# Altium project PCB_PowerAmplifier.PrjPcb
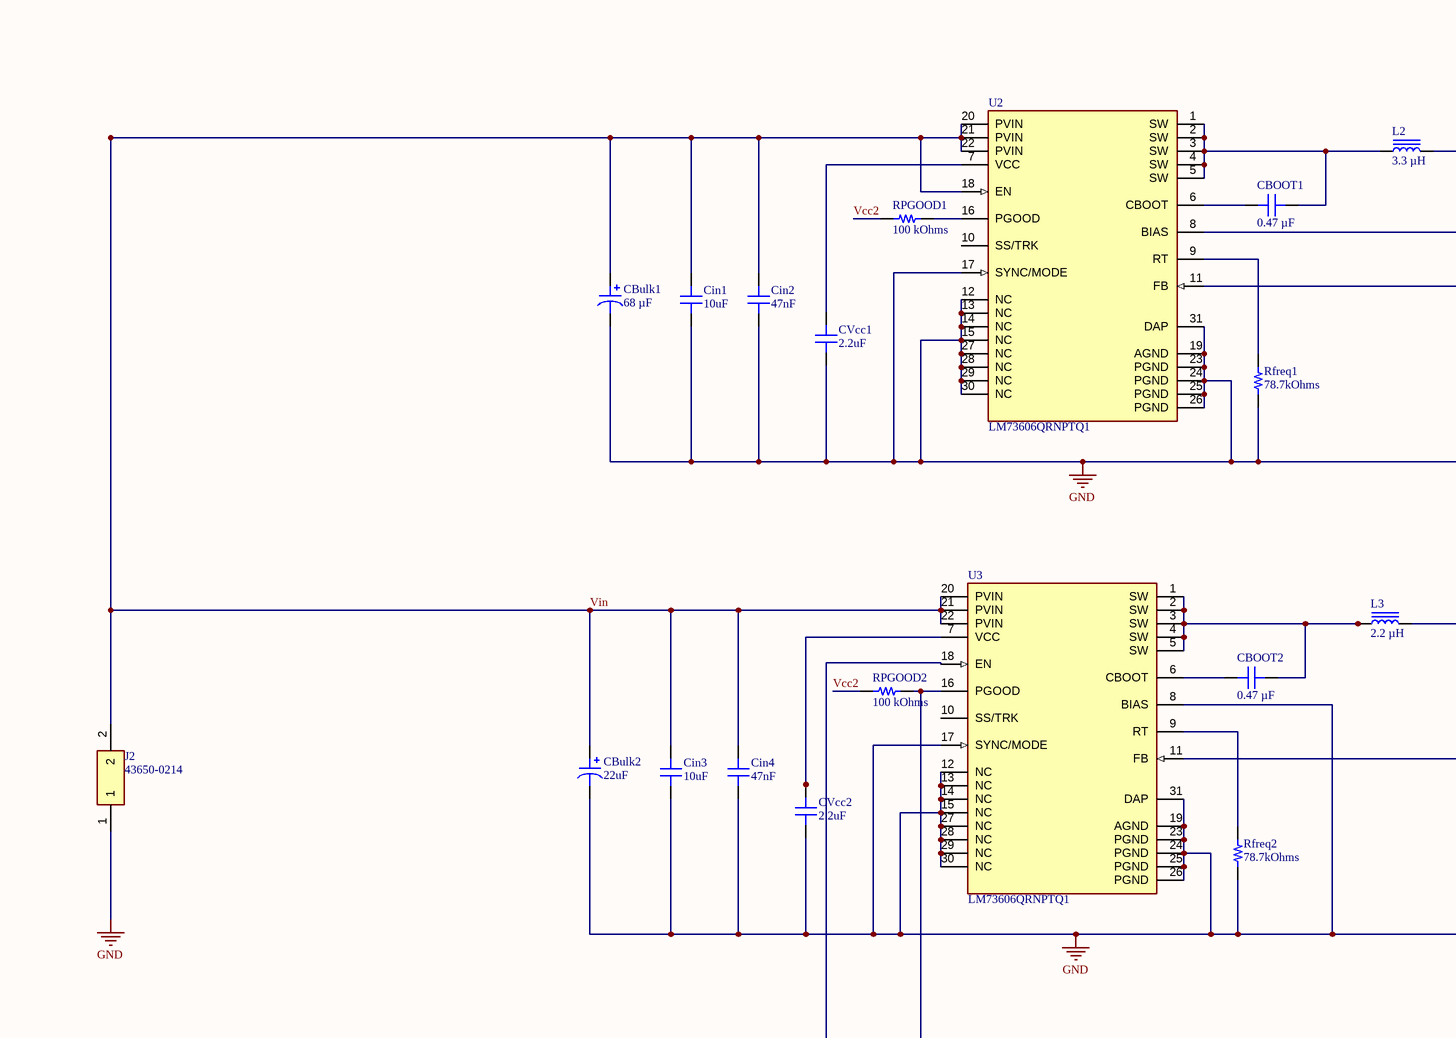
[diagram p0: Sheet1.SchDoc, top left]
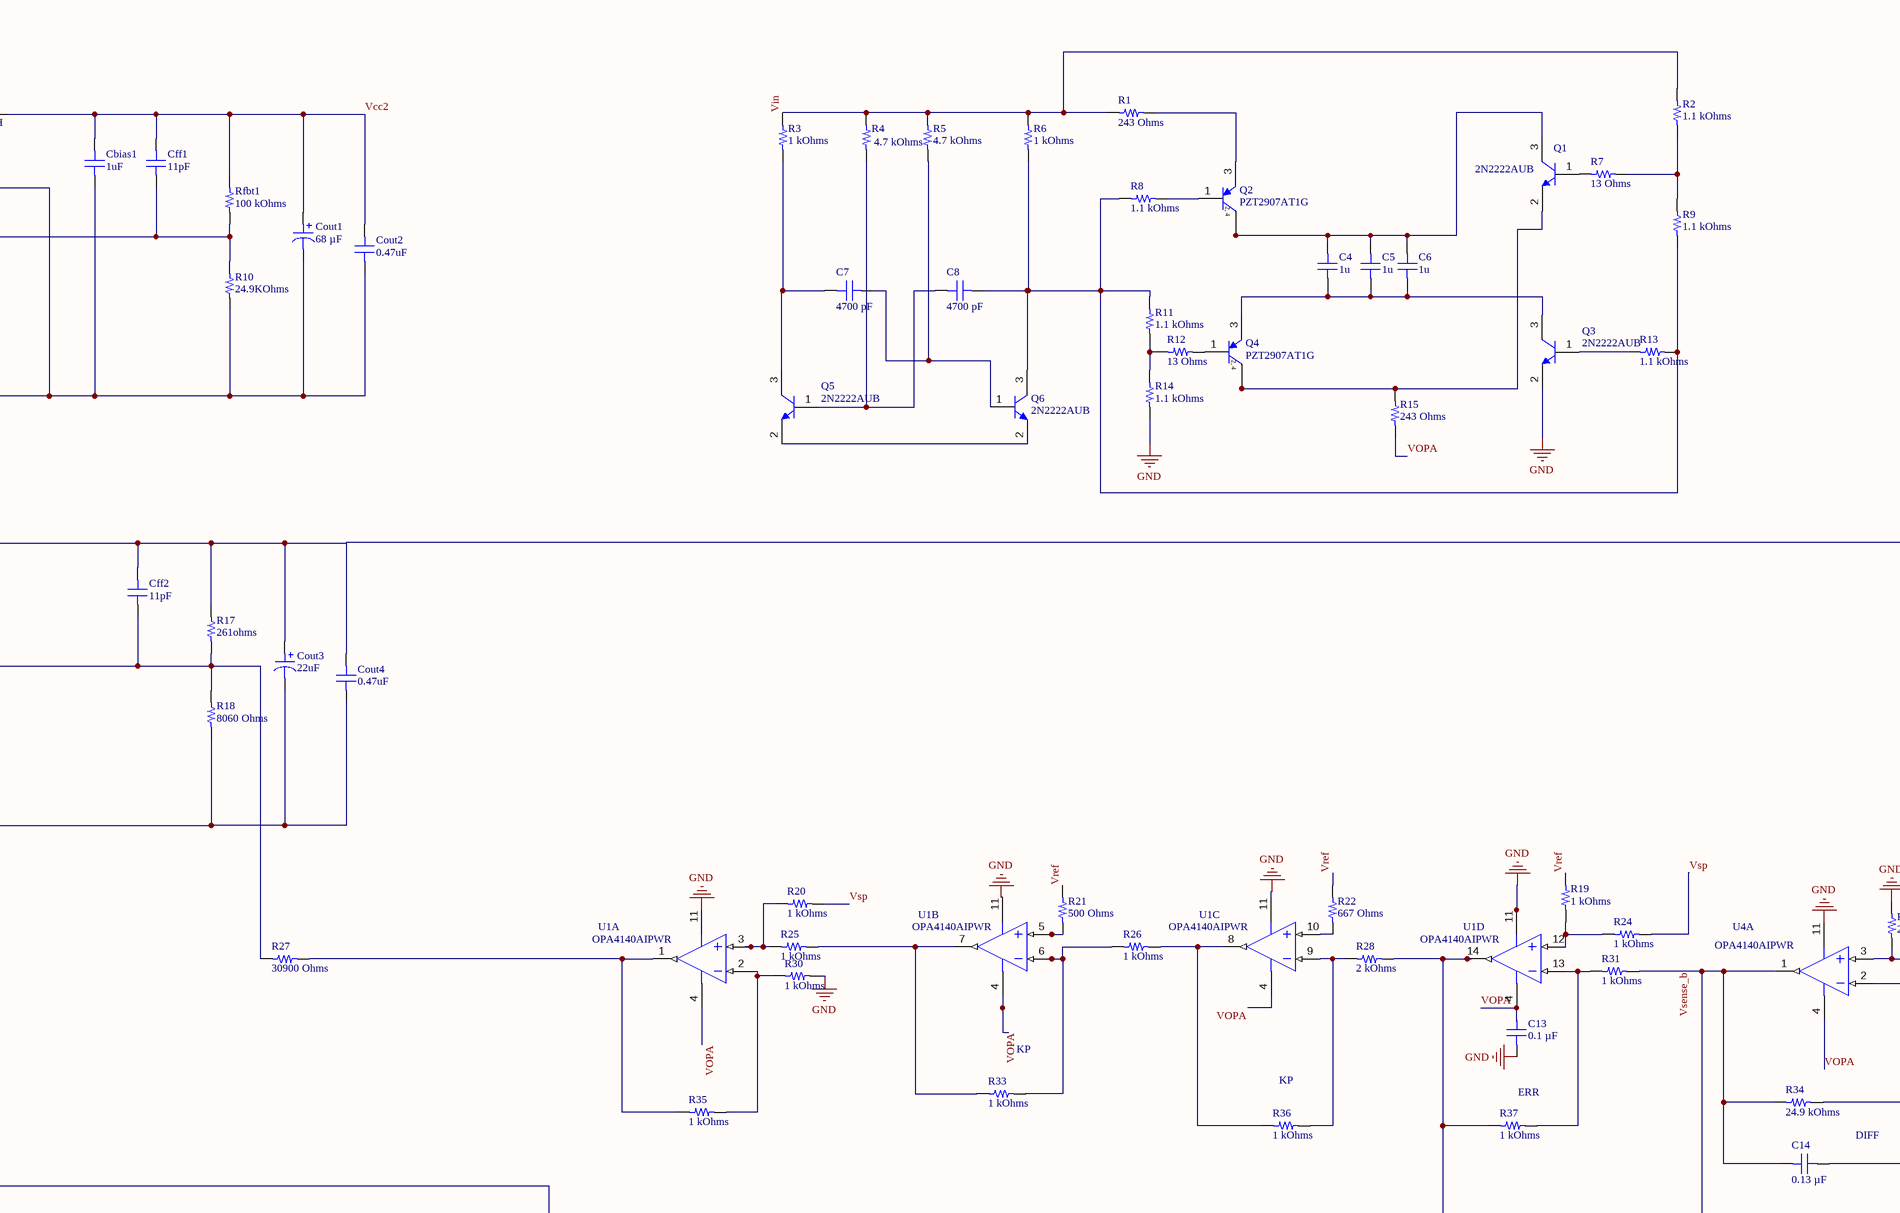
[diagram p1: Sheet1.SchDoc, top middle]
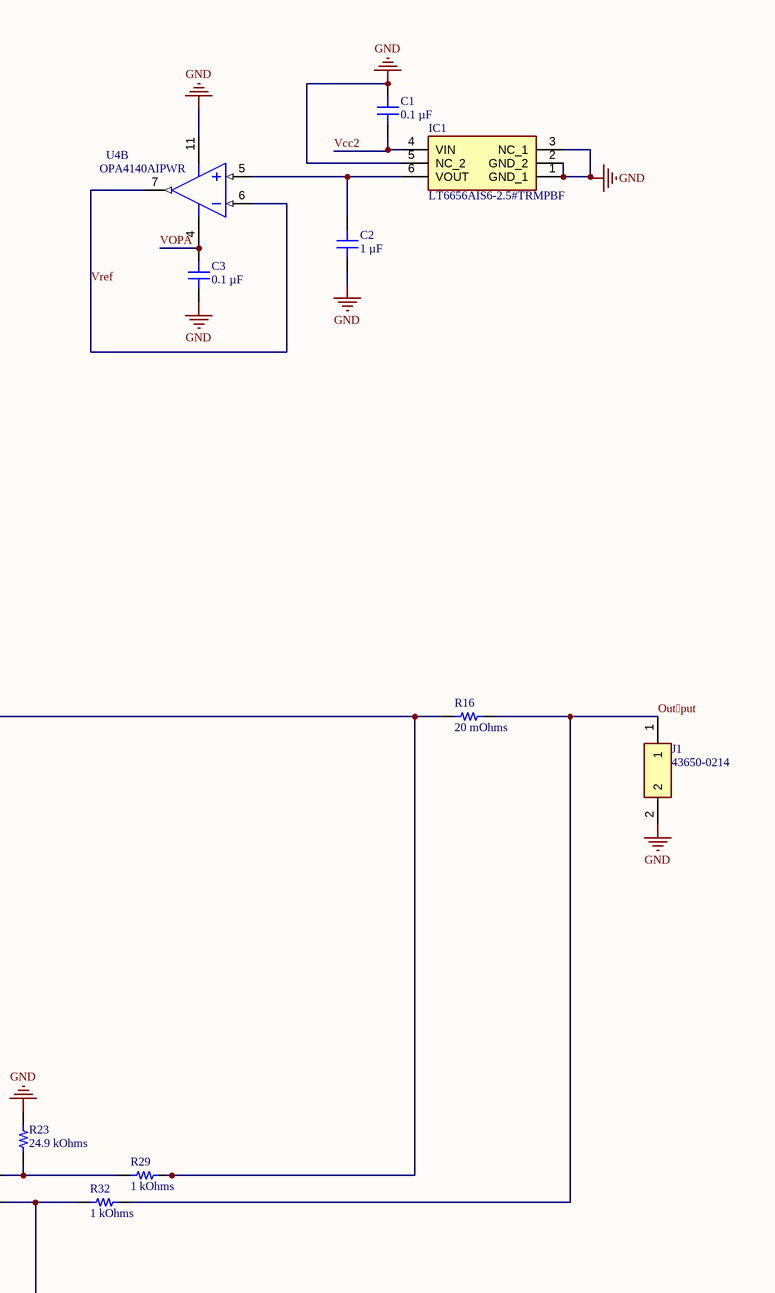
[diagram p2: Sheet1.SchDoc, top right]
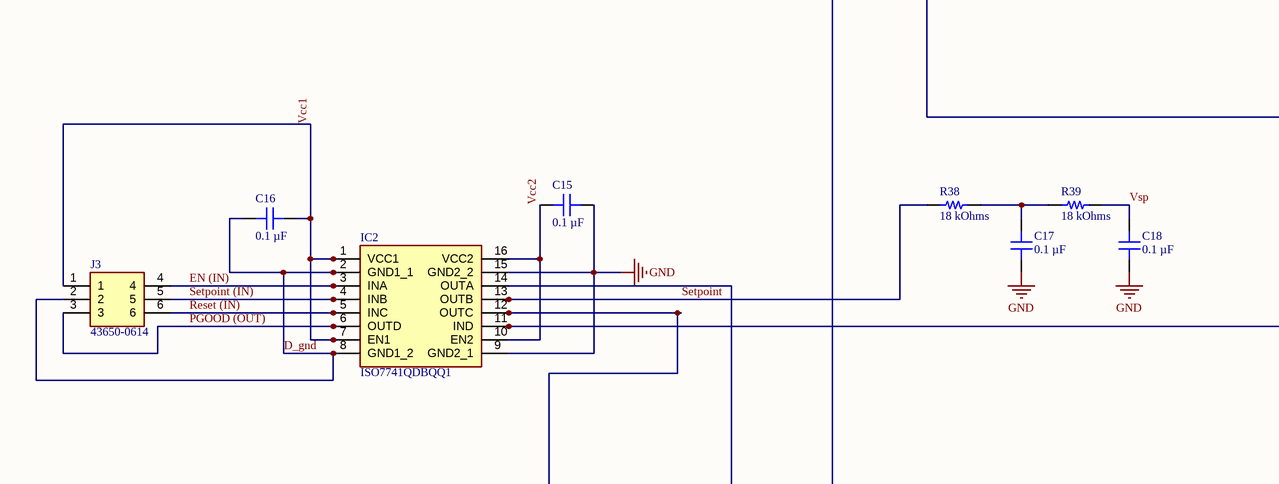
[diagram p3: Sheet1.SchDoc, bottom left]
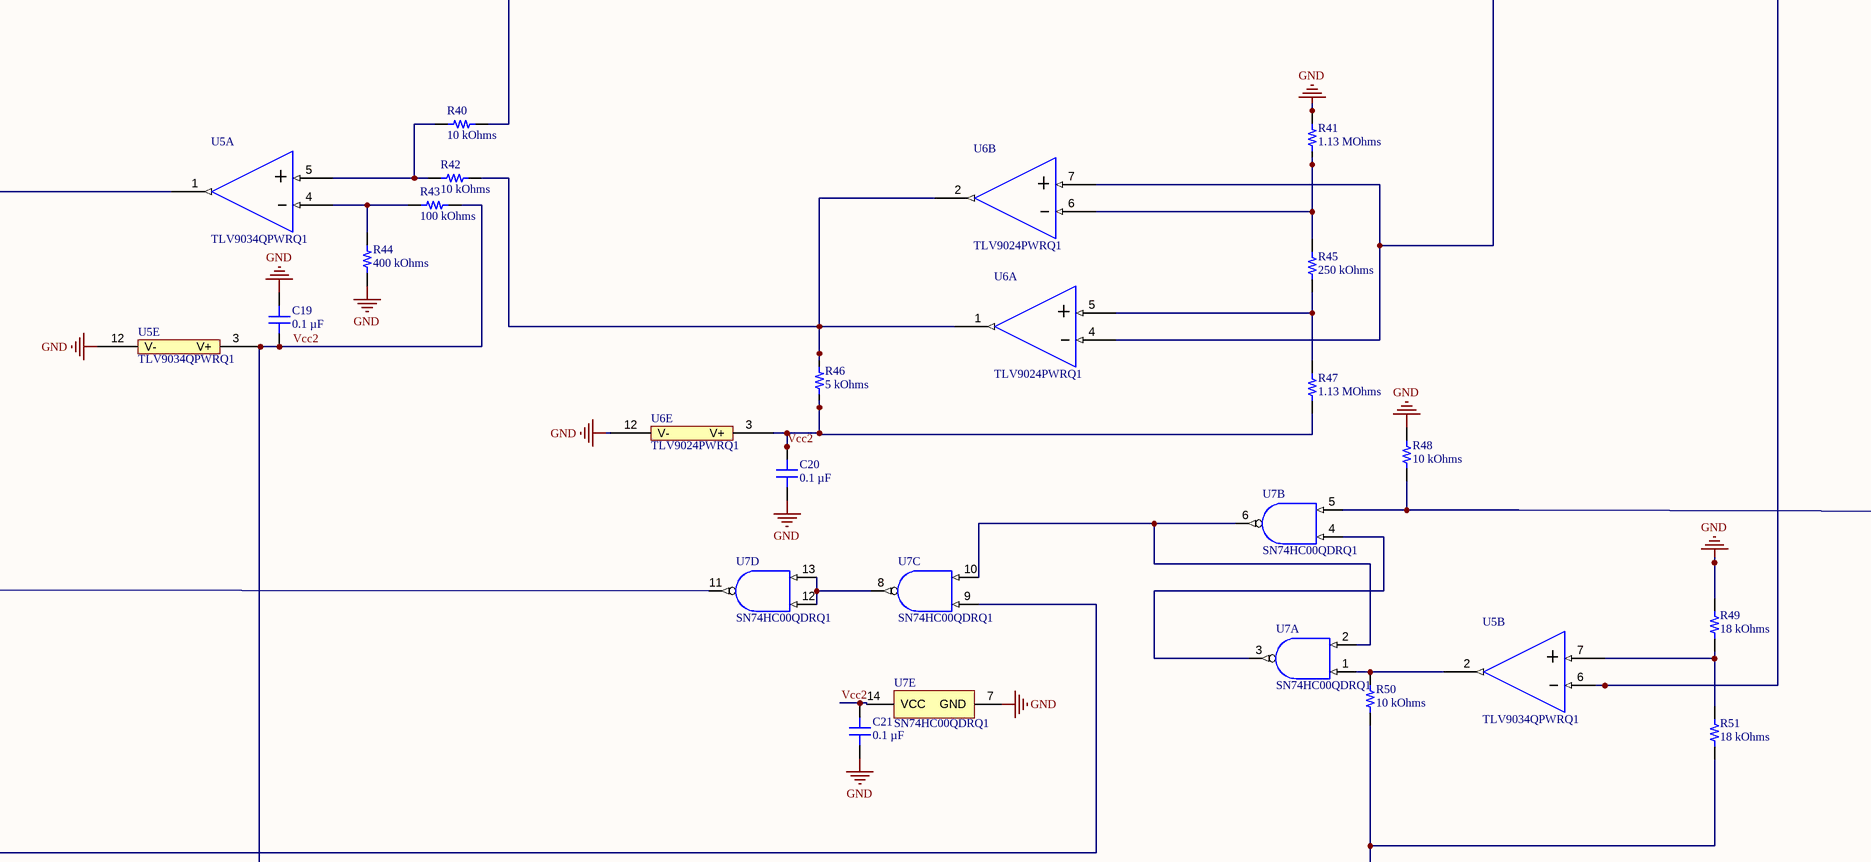
[diagram p4: Sheet1.SchDoc, bottom middle]
1 sheet, 110 parts. Net scope: global (net labels, ports and power ports of the same name join across sheets).
Board file: PCB1.PcbDoc

## Sheet Sheet1.SchDoc
size 863 x 558 mm; SheetNumber: 1; SheetTotal: 1

### Parts
C1  0.1 µF  [CAP 0805_2012]
C2  1 µF  [CAP 0805_2012]
C3  0.1 µF  [CAP 0805_2012]
C4  1u  [CAP 0805_2012]
C5  1u  [CAP 0805_2012]
C6  1u  [CAP 0805_2012]
C7  4700 pF  [CAP 0805_2012]
C8  4700 pF  [CAP 0805_2012]
C13  0.1 µF  [CAP 0805_2012]
C14  0.13 µF  [CAP 0805_2012]
C15  0.1 µF  [CAP 0805_2012]
C16  0.1 µF  [CAP 0805_2012]
C17  0.1 µF  [CAP 0805_2012]
C18  0.1 µF  [CAP 0805_2012]
C19  0.1 µF  [CAP 0805_2012]
C20  0.1 µF  [CAP 0805_2012]
C21  0.1 µF  [CAP 0805_2012]
Cbias1  1uF  [CAP 0805_2012]
CBOOT1  0.47 µF  [CAP 0805_2012]
CBOOT2  0.47 µF  [CAP 0805_2012]
CBulk1  68 µF  [CAP ALSMD 8.3MM H10.5MM]
CBulk2  22uF  [CAP ALSMD 8.3MM H10.5MM]
Cff1  11pF  [CAP 0805_2012]
Cff2  11pF  [CAP 0805_2012]
Cin1  10uF  [CAP 0805_2012]
Cin2  47nF  [CAP 0805_2012]
Cin3  10uF  [CAP 0805_2012]
Cin4  47nF  [CAP 0805_2012]
Cout1  68 µF  [CAP ALSMD 8.3MM H10.5MM]
Cout2  0.47uF  [CAP 0805_2012]
Cout3  22uF  [CAP ALSMD 8.3MM H10.5MM]
Cout4  0.47uF  [CAP 0805_2012]
CVcc1  2.2uF  [CAP 0805_2012]
CVcc2  2.2uF  [CAP 0805_2012]
IC1  LT6656AIS6-2.5#TRMPBF  [SOT95P280X100-6N]
IC2  ISO7741QDBQQ1  [SOP64P600X175-16N]
J1  43650-0214  [43650-02(12,13,14)]
J2  43650-0214  [43650-02(12,13,14)]
J3  43650-0614  [43650-06(12,13,14)]
L2  3.3 µH  [BOURNS SRR1280]
L3  2.2 µH  [WURTH WE-PD 1210]
Q1  2N2222AUB  [MCSM-2N2222AUB-3]
Q2  PZT2907AT1G  [ONSC-SOT-223-4-318E-04_V]
Q3  2N2222AUB  [MCSM-2N2222AUB-3]
Q4  PZT2907AT1G  [ONSC-SOT-223-4-318E-04_V]
Q5  2N2222AUB  [MCSM-2N2222AUB-3]
Q6  2N2222AUB  [MCSM-2N2222AUB-3]
R1  243 Ohms  [RES 0805_2012]
R2  1.1 kOhms  [RES 0805_2012]
R3  1 kOhms  [RES 0805_2012]
R4  4.7 kOhms  [RES 0805_2012]
R5  4.7 kOhms  [RES 0805_2012]
R6  1 kOhms  [RES 0805_2012]
R7  13 Ohms  [RES 0805_2012]
R8  1.1 kOhms  [RES 0805_2012]
R9  1.1 kOhms  [RES 0805_2012]
R10  24.9KOhms  [RES 0805_2012]
R11  1.1 kOhms  [RES 0805_2012]
R12  13 Ohms  [RES 0805_2012]
R13  1.1 kOhms  [RES 0805_2012]
R14  1.1 kOhms  [RES 0805_2012]
R15  243 Ohms  [RES 0805_2012]
R16  20 mOhms  [RES 0805_2012]
R17  261ohms  [RES 0805_2012]
R18  8060 Ohms  [RES 0805_2012]
R19  1 kOhms  [RES 0805_2012]
R20  1 kOhms  [RES 0805_2012]
R21  500 Ohms  [RES 0805_2012]
R22  667 Ohms  [RES 0805_2012]
R23  24.9 kOhms  [RES 0805_2012]
R24  1 kOhms  [RES 0805_2012]
R25  1 kOhms  [RES 0805_2012]
R26  1 kOhms  [RES 0805_2012]
R27  30900 Ohms  [RES 0805_2012]
R28  2 kOhms  [RES 0805_2012]
R29  1 kOhms  [RES 0805_2012]
R30  1 kOhms  [RES 0805_2012]
R31  1 kOhms  [RES 0805_2012]
R32  1 kOhms  [RES 0805_2012]
R33  1 kOhms  [RES 0805_2012]
R34  24.9 kOhms  [RES 0805_2012]
R35  1 kOhms  [RES 0805_2012]
R36  1 kOhms  [RES 0805_2012]
R37  1 kOhms  [RES 0805_2012]
R38  18 kOhms  [RES 0805_2012]
R39  18 kOhms  [RES 0805_2012]
R40  10 kOhms  [RES 0805_2012]
R41  1.13 MOhms  [RES 0805_2012]
R42  10 kOhms  [RES 0805_2012]
R43  100 kOhms  [RES 0805_2012]
R44  400 kOhms  [RES 0805_2012]
R45  250 kOhms  [RES 0805_2012]
R46  5 kOhms  [RES 0805_2012]
R47  1.13 MOhms  [RES 0805_2012]
R48  10 kOhms  [RES 0805_2012]
R49  18 kOhms  [RES 0805_2012]
R50  10 kOhms  [RES 0805_2012]
R51  18 kOhms  [RES 0805_2012]
Rfbt1  100 kOhms  [RES 0805_2012]
Rfreq1  78.7kOhms  [RES 0805_2012]
Rfreq2  78.7kOhms  [RES 0805_2012]
RPGOOD1  100 kOhms  [RES 0805_2012]
RPGOOD2  100 kOhms  [RES 0805_2012]
U1  OPA4140AIPWR  [PW0014A_L]  (parts A,B,C,D of 4)
U2  LM73606QRNPTQ1  [FP-RNP0030A-IPC_C]
U3  LM73606QRNPTQ1  [FP-RNP0030A-IPC_C]
U4  OPA4140AIPWR  [PW0014A_L]  (parts A,B of 4)
U5  TLV9034QPWRQ1  [TSOP65P640X120-14N]  (parts A,B,E of 5)
U6  TLV9024PWRQ1  [TSOP65P640X120-14N]  (parts A,B,E of 5)
U7  SN74HC00QDRQ1  [D0014A_L]  (parts A,B,C,D,E of 5)

### Nets
GND: C1.2 C2.1 C3.1 C13.1 C15.1 C17.1 C18.1 C19.2 C20.1 C21.1 Cbias1.1 CBulk1.2 CBulk2.2 Cin1.2 Cin2.2 Cin3.2 Cin4.2 Cout1.2 Cout2.1 Cout3.2 Cout4.1 CVcc1.2 CVcc2.2 IC1.1(GND_1) IC1.2(GND_2) IC1.3(NC_1) IC1.5(NC_2) IC2.9(GND2_1) IC2.15(GND2_2) J1.2 J2.1 Q3.2(E) R10.1 R14.2 R18.1 R23.1 R30.2 R41.2 R44.1 R48.2 R49.2 Rfreq1.1 Rfreq2.1 U1.11(V-) U2.8(BIAS) U2.12(NC) U2.13(NC) U2.14(NC) U2.15(NC) U2.17(SYNC/MODE) U2.19(AGND) U2.23(PGND) U2.24(PGND) U2.25(PGND) U2.26(PGND) U2.27(NC) U2.28(NC) U2.29(NC) U2.30(NC) U2.31(DAP) U3.8(BIAS) U3.12(NC) U3.13(NC) U3.14(NC) U3.15(NC) U3.17(SYNC/MODE) U3.19(AGND) U3.23(PGND) U3.24(PGND) U3.25(PGND) U3.26(PGND) U3.27(NC) U3.28(NC) U3.29(NC) U3.30(NC) U3.31(DAP) U4.11(V-) U5.12(V-) U6.12(V-) U7.7(GND)
D_gnd: C16.2 IC2.2(GND1_1) IC2.8(GND1_2) J3.2
EN (IN): IC2.3(INA) J3.4
Output: J1.1 R16.2 R32.2
PGOOD (OUT): IC2.6(OUTD) J3.3
Reset (IN): IC2.5(INC) J3.6
Setpoint: IC2.13(OUTB) R38.1
Setpoint (IN): IC2.4(INB) J3.5
Vcc1: C16.1 IC2.1(VCC1) IC2.7(EN1) J3.1
Vcc2: C1.1 C15.2 C19.1 C20.2 C21.2 Cbias1.2 Cff1.2 Cout1.1 Cout2.2 IC1.4(VIN) IC2.10(EN2) IC2.16(VCC2) L2.2 R43.1 R46.1 R47.1 R50.1 R51.1 Rfbt1.2 RPGOOD1.2 RPGOOD2.2 U5.3(V+) U6.3(V+) U7.14(VCC)
Vin: CBulk1.1 CBulk2.1 Cin1.1 Cin2.1 Cin3.1 Cin4.1 J2.2 R1.1 R2.1 R3.2 R4.2 R5.2 R6.2 U2.18(EN) U2.20(PVIN) U2.21(PVIN) U2.22(PVIN) U3.20(PVIN) U3.21(PVIN) U3.22(PVIN)
VOPA: C3.2 C13.2 R15.1 U1.4(V+) U4.4(V+)
Vref: R19.2 R21.2 R22.2 U4.6(IN_B-) U4.7(OUT_B)
Vsense_b: C14.2 R31.2 R34.2 U4.1(OUT_A) U5.6(IN2-)
Vsp: C18.2 R20.2 R24.2 R39.2
NetC2_2: C2.2 IC1.6(VOUT) U4.5(IN_B+)
NetC4_1: C4.1 C5.1 C6.1 Q3.3(C) Q4.3(E)
NetC4_2: C4.2 C5.2 C6.2 Q1.3(C) Q2.2(C) Q2.4(C)
NetC7_1: C7.1 Q5.3(C) R3.1
NetC7_2: C7.2 Q6.1(B) R5.1
NetC8_1: C8.1 Q5.1(B) R4.1
NetC8_2: C8.2 Q6.3(C) R6.1 R8.2 R9.2 R11.1 R13.1
NetC14_1: C14.1 R32.1 R34.1 U4.2(IN_A-)
NetC17_2: C17.2 R38.2 R39.1
NetCBOOT1_1: CBOOT1.1 L2.1 U2.1(SW) U2.2(SW) U2.3(SW) U2.4(SW) U2.5(SW)
NetCBOOT1_2: CBOOT1.2 U2.6(CBOOT)
NetCBOOT2_1: CBOOT2.1 L3.1 U3.1(SW) U3.2(SW) U3.3(SW) U3.4(SW) U3.5(SW)
NetCBOOT2_2: CBOOT2.2 U3.6(CBOOT)
NetCff1_1: Cff1.1 R10.2 Rfbt1.1 U2.11(FB)
NetCff2_1: Cff2.1 R17.1 R18.2 R27.1 U3.11(FB)
NetCff2_2: Cff2.2 Cout3.1 Cout4.2 L3.2 R17.2
NetCVcc1_1: CVcc1.1 U2.7(VCC)
NetCVcc2_1: CVcc2.1 U3.7(VCC)
NetIC2_11: IC2.11(IND) U5.1(OUT2)
NetIC2_12: IC2.12(OUTC) R48.1 U7.5(2B)
NetIC2_14: IC2.14(OUTA) U7.9(3A)
NetQ1_1: Q1.1(B) R7.1
NetQ1_2: Q1.2(E) Q4.2(C) Q4.4(C) R15.2
NetQ2_1: Q2.1(B) R8.1
NetQ2_3: Q2.3(E) R1.2
NetQ3_1: Q3.1(B) R13.2
NetQ4_1: Q4.1(B) R12.2
NetQ5_2: Q5.2(E) Q6.2(E)
NetR2_2: R2.2 R7.2 R9.1
NetR11_2: R11.2 R12.1 R14.1
NetR16_1: R16.1 R29.2
NetR19_1: R19.1 R24.1 U1.12(IN_D+)
NetR20_1: R20.1 R25.1 U1.3(IN_A+)
NetR21_1: R21.1 U1.5(IN_B+)
NetR22_1: R22.1 U1.10(IN_C+)
NetR23_2: R23.2 R29.1 U4.3(IN_A+)
NetR25_2: R25.2 R33.1 U1.7(OUT_B)
NetR26_1: R26.1 R33.2 U1.6(IN_B-)
NetR26_2: R26.2 R36.1 U1.8(OUT_C)
NetR27_2: R27.2 R35.1 U1.1(OUT_A)
NetR28_1: R28.1 R36.2 U1.9(IN_C-)
NetR28_2: R28.2 R37.1 U1.14(OUT_D) U6.4(IN1-) U6.7(IN2+)
NetR30_1: R30.1 R35.2 U1.2(IN_A-)
NetR31_1: R31.1 R37.2 U1.13(IN_D-)
NetR40_1: R40.1 RPGOOD2.1 U3.16(PGOOD)
NetR40_2: R40.2 R42.2 U5.5(IN1+)
NetR41_1: R41.1 R45.2 U6.6(IN2-)
NetR42_1: R42.1 R46.2 U6.1(OUT2) U6.2(OUT1)
NetR43_2: R43.2 R44.2 U5.4(IN1-)
NetR45_1: R45.1 R47.2 U6.5(IN1+)
NetR49_1: R49.1 R51.2 U5.7(IN2+)
NetR50_2: R50.2 U5.2(OUT1) U7.1(1A)
NetRfreq1_2: Rfreq1.2 U2.9(RT)
NetRfreq2_2: Rfreq2.2 U3.9(RT)
NetRPGOOD1_1: RPGOOD1.1 U2.16(PGOOD)
NetU3_18: U3.18(EN) U7.11(4Y)
NetU7_2: U7.2(1B) U7.6(2Y) U7.10(3B)
NetU7_3: U7.3(1Y) U7.4(2A)
NetU7_8: U7.8(3Y) U7.12(4A) U7.13(4B)

Not connected (* = marked no-connect by the designer): U2 10(SS/TRK); U3 10(SS/TRK)

### Notes on the sheet
- (near R33) KP
- (near R36) KP
- (near R37) ERR
- DIFF
- DWG. NO.
- REV.
- SHT.
- REVISION
- DESCRIPTION
- DATE
- APPROVED
- THIS DOCUMENT AND THE DATA DISCLOSED HEREIN OR HEREWITH IS THE PROPERTY OF ALTIUM LIMITED AND MAY BE FREELY DISTRIBUTED IN WHOLE. NO RIGHTS ARE RESERVED OR EXPRESS OR IMPLIED WARANTEE GIVEN.
- ENG:
- DSN:
- APPROVALS
- PROJECT
- DOCUMENT REVISION:
- DESIGN ITEM:
- CHK:
- BOM:
- REFERENCE DOCUMENTS
- PROJECT REVISION:
- TITLE
- FAB DWG:
- PCB DWG:
- ASSY DWG:
- SCALE:
- SIZE
- D
- CAGE CODE
- FILE NAME
- DWG NO.
- SHEET
- OF
- REV
- (in symbol CMP-1048-00010-1) 2, 4

### Library data of the parts
C1 C3 C13 = CC0805MRX7R9BB104: CAP CER 0.1UF 50V X7R 0805; manufacturer: Yageo; Tolerance: ±20%; Part Number: CC0805MRX7R9BB104; Value: 0.1 µF; Applications: General Purpose; Capacitance: 0.1 µF; componentlink1description: Datasheet; componentlink1url: https://www.yageo.com/upload/media/product/productsearch/datasheet/mlcc/UPY-GPHC_X7R_6.3V-to-50V_18.pdf; componentlink2description: DigiKey Link; componentlink2url: https://www.digikey.com/en/products/detail/yageo/CC0805MRX7R9BB104/5884281; Device Package: 0805 (2012 Metric); lastupdated: 09-08-2023 19:14:28; Lifecycle Status: Active; Minimum Order: 1; Mounting Type: Surface Mount, MLCC; Operating Temperature: -55°C ~ 125°C; Package / Case: 0805 (2012 Metric); packaging: TapeAndReel; partid: 2475; Part Status: Active; price: 0.01; series: CC; Size / Dimension: 0.079" L x 0.049" W (2.00mm x 1.25mm); Supplier 1: DigiKey; Supplier Part Number 1: 311-4351-1-ND; Temperature Coefficient: X7R; Thickness (Max): 0.037" (0.95mm); Voltage - Rated: 50V
C2 C14 = CC0805MRX7R9BB104: CAP CER 0.1UF 50V X7R 0805; manufacturer: Yageo; Capacitance: 0.1 µF; Tolerance: ±20%; Part Number: CC0805MRX7R9BB104; Applications: General Purpose; componentlink1description: Datasheet; componentlink1url: https://www.yageo.com/upload/media/product/productsearch/datasheet/mlcc/UPY-GPHC_X7R_6.3V-to-50V_18.pdf; componentlink2description: DigiKey Link; componentlink2url: https://www.digikey.com/en/products/detail/yageo/CC0805MRX7R9BB104/5884281; Device Package: 0805 (2012 Metric); lastupdated: 09-08-2023 19:14:28; Lifecycle Status: Active; Minimum Order: 1; Mounting Type: Surface Mount, MLCC; Operating Temperature: -55°C ~ 125°C; Package / Case: 0805 (2012 Metric); packaging: TapeAndReel; partid: 2475; Part Status: Active; price: 0.01; series: CC; Size / Dimension: 0.079" L x 0.049" W (2.00mm x 1.25mm); Supplier 1: DigiKey; Supplier Part Number 1: 311-4351-1-ND; Temperature Coefficient: X7R; Thickness (Max): 0.037" (0.95mm); Voltage - Rated: 50V
  C2: Value: 1 µF
  C14: Value: 0.13 µF
C4-C6 = C0805C472F3GECAUTO7210: CAP CER 0805 4.7NF 25V C0G 1%; manufacturer: KEMET; Capacitance: 4700 pF; Temperature Coefficient: C0G, NP0; Part Number: C0805C472F3GECAUTO7210; Value: 1u; Applications: Automotive, ESD Protection; componentlink1description: Datasheet; componentlink1url: https://connect.kemet.com:7667/gateway/IntelliData-ComponentDocumentation/1.0/download/datasheet/C0805C472F3GECAUTO7210; componentlink2description: DigiKey Link; componentlink2url: https://www.digikey.com/en/products/detail/kemet/C0805C472F3GECAUTO7210/8648690; Device Package: 0805 (2012 Metric); Features: Low ESL; lastupdated: 15-11-2023 20:12:00; Lifecycle Status: Active; Minimum Order: 1; Mounting Type: Surface Mount, MLCC; Operating Temperature: -55°C ~ 125°C; Package / Case: 0805 (2012 Metric); packaging: TapeAndReel; partid: 54380; Part Status: Active; price: 0.30; Ratings: AEC-Q200; series: ESD SMD Auto C0G; Size / Dimension: 0.079" L x 0.049" W (2.00mm x 1.25mm); Supplier 1: DigiKey; Supplier Part Number 1: 399-C0805C472F3GECAUTO7210CT-ND; Thickness (Max): 0.039" (1.00mm); Tolerance: ±1%; Voltage - Rated: 25V
C7 C8 = C0805C472F3GECAUTO7210: CAP CER 0805 4.7NF 25V C0G 1%; manufacturer: KEMET; Temperature Coefficient: C0G, NP0; Part Number: C0805C472F3GECAUTO7210; Value: 4700 pF; Applications: Automotive, ESD Protection; Capacitance: 4700 pF; componentlink1description: Datasheet; componentlink1url: https://connect.kemet.com:7667/gateway/IntelliData-ComponentDocumentation/1.0/download/datasheet/C0805C472F3GECAUTO7210; componentlink2description: DigiKey Link; componentlink2url: https://www.digikey.com/en/products/detail/kemet/C0805C472F3GECAUTO7210/8648690; Device Package: 0805 (2012 Metric); Features: Low ESL; lastupdated: 15-11-2023 20:12:00; Lifecycle Status: Active; Minimum Order: 1; Mounting Type: Surface Mount, MLCC; Operating Temperature: -55°C ~ 125°C; Package / Case: 0805 (2012 Metric); packaging: TapeAndReel; partid: 54380; Part Status: Active; price: 0.30; Ratings: AEC-Q200; series: ESD SMD Auto C0G; Size / Dimension: 0.079" L x 0.049" W (2.00mm x 1.25mm); Supplier 1: DigiKey; Supplier Part Number 1: 399-C0805C472F3GECAUTO7210CT-ND; Thickness (Max): 0.039" (1.00mm); Tolerance: ±1%; Voltage - Rated: 25V
C15-C21 = 250X15W104MV4E: CAP CER 0.1UF 25V X7R 0805; manufacturer: Johanson Dielectrics Inc.; Tolerance: ±20%; Part Number: 250X15W104MV4E; Value: 0.1 µF; Applications: Bypass, Decoupling; Capacitance: 0.1 µF; componentlink1description: Datasheet; componentlink1url: https://www.johansondielectrics.com/downloads/x2y-filter-and-decoupling-capacitors.pdf; componentlink2description: DigiKey Link; componentlink2url: https://www.digikey.com/en/products/detail/johanson-dielectrics-inc/250X15W104MV4E/2327204; Device Package: 0805 (2012 Metric); Features: Low ESL (X2Y); lastupdated: 01-11-2023 19:15:18; Lifecycle Status: Active; Minimum Order: 1; Mounting Type: Surface Mount, MLCC; Operating Temperature: -55°C ~ 125°C; Package / Case: 0805 (2012 Metric); packaging: TapeAndReel; partid: 44301; Part Status: Active; price: 0.17; series: X2Y®; Size / Dimension: 0.080" L x 0.050" W (2.03mm x 1.27mm); Supplier 1: DigiKey; Supplier Part Number 1: 709-1330-1-ND; Temperature Coefficient: X7R; Thickness (Max): 0.040" (1.02mm); Voltage - Rated: 25V
Cbias1 CBOOT1 CBOOT2 Cff1 Cff2 Cin1-Cin4 Cout2 Cout4 CVcc1 CVcc2 = 250X15W104MV4E: CAP CER 0.1UF 25V X7R 0805; manufacturer: Johanson Dielectrics Inc.; Capacitance: 0.1 µF; Tolerance: ±20%; Part Number: 250X15W104MV4E; Applications: Bypass, Decoupling; componentlink1description: Datasheet; componentlink1url: https://www.johansondielectrics.com/downloads/x2y-filter-and-decoupling-capacitors.pdf; componentlink2description: DigiKey Link; componentlink2url: https://www.digikey.com/en/products/detail/johanson-dielectrics-inc/250X15W104MV4E/2327204; Device Package: 0805 (2012 Metric); Features: Low ESL (X2Y); lastupdated: 01-11-2023 19:15:18; Lifecycle Status: Active; Minimum Order: 1; Mounting Type: Surface Mount, MLCC; Operating Temperature: -55°C ~ 125°C; Package / Case: 0805 (2012 Metric); packaging: TapeAndReel; partid: 44301; Part Status: Active; price: 0.17; series: X2Y®; Size / Dimension: 0.080" L x 0.050" W (2.03mm x 1.27mm); Supplier 1: DigiKey; Supplier Part Number 1: 709-1330-1-ND; Temperature Coefficient: X7R; Thickness (Max): 0.040" (1.02mm); Voltage - Rated: 25V
  Cbias1: Value: 1uF
  CBOOT1 CBOOT2: Value: 0.47 µF
  Cff1 Cff2: Value: 11pF
  Cin1 Cin3: Value: 10uF
  Cin2 Cin4: Value: 47nF
  Cout2 Cout4: Value: 0.47uF
  CVcc1 CVcc2: Value: 2.2uF
CBulk1 Cout1 = EEE-FK1J680UP: CAP ALUM 68UF 20% 63V SMD; manufacturer: Panasonic Electronic Components; Impedance: 650 mOhms; Lifetime @ Temp.: 2000 Hrs @ 105°C; Polarization: Polar; Ripple Current @ High Frequency: 250 mA @ 100 kHz; Ripple Current @ Low Frequency: 187.5 mA @ 120 Hz; Surface Mount Land Size: 0.327" L x 0.327" W (8.30mm x 8.30mm); Part Number: EEE-FK1J680UP; Applications: Automotive; Capacitance: 68 µF; componentlink2description: DigiKey Link; componentlink2url: https://www.digikey.com/en/products/detail/panasonic-electronic-components/EEE-FK1J680UP/949812; Device Package: Radial, Can - SMD; Height - Seated (Max): 0.413" (10.50mm); lastupdated: 06-07-2023 20:33:13; Lifecycle Status: Active; Minimum Order: 1; Mounting Type: Surface Mount; Operating Temperature: -55°C ~ 105°C; Package / Case: Radial, Can - SMD; packaging: TapeAndReel; partid: 7487; Part Status: Active; price: 0.26; Ratings: AEC-Q200; series: FK; Size / Dimension: 0.315" Dia (8.00mm); Supplier 1: DigiKey; Supplier Part Number 1: PCE4307CT-ND; Tolerance: ±20%; value: 68 µF; Voltage - Rated: 63 V
CBulk2 Cout3 = EEE-FK1J680UP: CAP ALUM 68UF 20% 63V SMD; manufacturer: Panasonic Electronic Components; Capacitance: 68 µF; Impedance: 650 mOhms; Lifetime @ Temp.: 2000 Hrs @ 105°C; Polarization: Polar; Ripple Current @ High Frequency: 250 mA @ 100 kHz; Ripple Current @ Low Frequency: 187.5 mA @ 120 Hz; Surface Mount Land Size: 0.327" L x 0.327" W (8.30mm x 8.30mm); value: 68 µF; Part Number: EEE-FK1J680UP; Applications: Automotive; componentlink2description: DigiKey Link; componentlink2url: https://www.digikey.com/en/products/detail/panasonic-electronic-components/EEE-FK1J680UP/949812; Device Package: Radial, Can - SMD; Height - Seated (Max): 0.413" (10.50mm); lastupdated: 06-07-2023 20:33:13; Lifecycle Status: Active; Minimum Order: 1; Mounting Type: Surface Mount; Operating Temperature: -55°C ~ 105°C; Package / Case: Radial, Can - SMD; packaging: TapeAndReel; partid: 7487; Part Status: Active; price: 0.26; Ratings: AEC-Q200; series: FK; Size / Dimension: 0.315" Dia (8.00mm); Supplier 1: DigiKey; Supplier Part Number 1: PCE4307CT-ND; Tolerance: ±20%; Voltage - Rated: 63 V
IC1 = LT6656AIS6-2.5#TRMPBF: Integrated Circuit; Manufacturer_Name: Analog Devices; Datasheet Link: https://datasheet.datasheetarchive.com/originals/distributors/Datasheets_SAMA/d53d0df16fa3c9e3cd0282524dab6a3f.pdf; Height: 1mm; Manufacturer_Part_Number: LT6656AIS6-2.5#TRMPBF; Mouser Part Number: 584-6656AIS6-2.5TMPF; Mouser Price/Stock: https://www.mouser.co.uk/ProductDetail/Analog-Devices/LT6656AIS6-25TRMPBF?qs=hVkxg5c3xu%252BJt7EHt6GCkQ%3D%3D; Arrow Part Number: LT6656AIS6-2.5#TRMPBF; Arrow Price/Stock: https://www.arrow.com/en/products/lt6656ais6-2.5trmpbf/analog-devices?region=nac
IC2 = ISO7741QDBQQ1: Integrated Circuit; Manufacturer_Name: Texas Instruments; Datasheet Link: http://www.ti.com/lit/gpn/iso7741-q1; Height: 1.75mm; Manufacturer_Part_Number: ISO7741QDBQQ1; Mouser Part Number: 595-ISO7741QDBQQ1; Mouser Price/Stock: https://www.mouser.co.uk/ProductDetail/Texas-Instruments/ISO7741QDBQQ1?qs=5aG0NVq1C4w%252Bshfa2Wpgcw%3D%3D; Arrow Part Number: ISO7741QDBQQ1; Arrow Price/Stock: https://www.arrow.com/en/products/iso7741qdbqq1/texas-instruments
J1 J2 = 43650-0214: Connector; Manufacturer_Name: Molex; Datasheet Link: https://www.molex.com/pdm_docs/sd/436500212_sd.pdf; Height: 5.57mm; Manufacturer_Part_Number: 43650-0214; Mouser Part Number: 538-43650-0214; Mouser Price/Stock: https://www.mouser.co.uk/ProductDetail/Molex/43650-0214?qs=z57USrEQgt1S%2Fhgsj%2FblDA%3D%3D
J3 = 43650-0614: Connector; Manufacturer_Name: Molex; Datasheet Link: https://www.molex.com/pdm_docs/sd/436500212_sd.pdf; Height: 5.57mm; Manufacturer_Part_Number: 43650-0614; Mouser Part Number: 538-43650-0614; Mouser Price/Stock: https://www.mouser.com/Search/Refine.aspx?Keyword=538-43650-0614
L2 = SRR1280-3R3Y: FIXED IND 3.3UH 8.8A 12 MOHM SMD; Manufacturer: Bourns Inc.; Current - Saturation: 9.8A; DC Resistance (DCR): 12mOhm Max; Frequency - Self Resonant: 40MHz; Inductance Frequency - Test: 100 kHz; Material - Core: Ferrite; Q @ Freq: 20 @ 7.96MHz; Shielding: Shielded; Tolerance: ±30%; Type: Drum Core, Wirewound; Part Number: SRR1280-3R3Y; ComponentLink1Description: Datasheet; ComponentLink1URL: https://www.bourns.com/docs/Product-Datasheets/SRR1280.pdf; ComponentLink2Description: DigiKey Link; ComponentLink2URL: https://www.digikey.com/en/products/detail/bourns-inc/SRR1280-3R3Y/2562410; Current Rating (Amps): 8.8 A; Device Package: Nonstandard; Height - Seated (Max): 0.315" (8.00mm); Inductance: 3.3 µH; LastUpdated: 12/29/2023 9:30:16 PM; Lifecycle Status: Active; Minimum Order: 1; Mounting Type: Surface Mount; Operating Temperature: -40°C ~ 125°C; Package / Case: Nonstandard; Packaging: TapeAndReel; PartId: 17; Part Status: Active; Price: 0.51; Series: SRR1280; Size / Dimension: 0.492" L x 0.492" W (12.50mm x 12.50mm); Supplier 1: DigiKey; Supplier Part Number 1: SRR1280-3R3YCT-ND; Value: 3.3 µH
L3 = 7447709002: FIXED IND 2.2UH 11.5A 6 MOHM SMD; Manufacturer: Würth Elektronik; Current - Saturation: 20A; DC Resistance (DCR): 6mOhm Max; Frequency - Self Resonant: 65MHz; Inductance Frequency - Test: 1 kHz; Material - Core: Ferrite; Shielding: Shielded; Tolerance: ±20%; Type: Drum Core, Wirewound; Part Number: 7447709002; ComponentLink1Description: Datasheet; ComponentLink1URL: https://katalog.we-online.de/pbs/datasheet/7447709002.pdf; ComponentLink2Description: DigiKey Link; ComponentLink2URL: https://www.digikey.com/en/products/detail/würth-elektronik/7447709002/1638642; Current Rating (Amps): 11.5 A; Device Package: Nonstandard; Height - Seated (Max): 0.394" (10.00mm); Inductance: 2.2 µH; LastUpdated: 1/19/2024 9:56:38 PM; Lifecycle Status: Active; Minimum Order: 1; Mounting Type: Surface Mount; Operating Temperature: -40°C ~ 125°C; Package / Case: Nonstandard; Packaging: TapeAndReel; PartId: 5671; Part Status: Active; Price: 1.48; Ratings: AEC-Q200; Series: WE-PD; Size / Dimension: 0.472" L x 0.472" W (12.00mm x 12.00mm); Supplier 1: DigiKey; Supplier Part Number 1: 732-7447709002CT-ND; Value: 2.2 µH
Q1 Q3 Q5 Q6 = CMP-2000-07613-1: NPN Transistor, 50 V, 0.8 A, -65 to 200 degC, 3-Pin SMD, Tray; Manufacturer: Microsemi; Maximum Collector Base Voltage: 75V; Maximum Power Dissipation: 500mW; Maximum Collector Emitter Voltage: 50V; Maximum DC Collector Current: 0.8A; Minimum DC Current Gain: 50@0.1mA@10V; Maximum Collector Emitter Saturation Voltage: 0.3@15mA@150mA; Rad Hard: No; Type: NPN; Package Description: 3-Pin Surface Mount Device, Body 3.085 x 2.45 mm, Pitch 0.955 mm; Operating Temperature: -65to200°C; Manufacturer URL: http://www.microsemi.com/; Packaging: WafflePack; Package Reference: 2N2222AUB; Datasheet Version: Rev. 2, 03/2010; Datasheet URL: http://datasheet.octopart.com/2N2222AUB-Microsemi-datasheet-11765791.pdf; Pin Count: 3; Category: GPBJT; Mounting: SurfaceMount; Package: 3UB
Q2 Q4 = CMP-1048-00010-1: PNP Silicon Epitaxial Transistor, 4-Pin SOT-223, Pb-Free, Tape and Reel; Manufacturer: On Semiconductor; fT Min (MHz): 200; IC Continuous (A): -0.6; RoHS: TRUE; ComponentLink2URL: http://www.onsemi.com/pub_link/Collateral/PZT2907AT1-D.PDF; ComponentLink1Description: Manufacturer URL; Mounting Technology: Surface Mount; Polarity: PNP; PackageVersion: Rev. N, 08/2009; ComponentLink3URL: http://www.onsemi.com/pub_link/Collateral/318E-04.PDF; ComponentLink1URL: http://www.onsemi.com/; Packing: Tape and Reel; DatasheetVersion: Rev. 10; ComponentLink2Description: Datasheet; PackageReference: SOT-223-4-318E-04; ComponentLink3Description: Package Specification; PackageDescription: 4-Pin Small Outline Transistor, Body 6.5 x 3.5 mm, Pitch 2.3 mm; PartNumber: PZT2907AT1G
R1-R3 R6-R9 R11-R15 = AC0805FR-074K7L: RES SMD 4.7K OHM 1% 1/8W 0805; Manufacturer: Yageo; Power (Watts): 0.125W, 1/8W; Resistance: 4.7 kOhms; Temperature Coefficient: ±100ppm/°C; Part Number: AC0805FR-074K7L; ComponentLink1Description: Datasheet; ComponentLink1URL: https://www.yageo.com/upload/media/product/productsearch/datasheet/rchip/PYu-AC_51_RoHS_L_7.pdf; ComponentLink2Description: DigiKey Link; ComponentLink2URL: https://www.digikey.com/en/products/detail/yageo/AC0805FR-074K7L/5896876; Composition: Thick Film; Device Package: 0805 (2012 Metric); Features: Automotive AEC-Q200, Moisture Resistant; Height - Seated (Max): 0.024" (0.60mm); LastUpdated: 14-11-2023 20:58:50; Lifecycle Status: Active; Minimum Order: 1; Number of Terminations: 2; Operating Temperature: -55°C ~ 155°C; Package / Case: 0805 (2012 Metric); Packaging: TapeAndReel; PartId: 34661; Part Status: Active; Price: 0.01; Ratings: AEC-Q200; Series: AC; Size / Dimension: 0.079" L x 0.049" W (2.00mm x 1.25mm); Supplier 1: DigiKey; Supplier Part Number 1: YAG3738CT-ND; Supplier Device Package: 0805; Tolerance: ±1%
  R1 R15: Value: 243 Ohms
  R2 R8 R9 R11 R13 R14: Value: 1.1 kOhms
  R3 R6: Value: 1 kOhms
  R7 R12: Value: 13 Ohms
R4 R5 = AC0805FR-074K7L: RES SMD 4.7K OHM 1% 1/8W 0805; Manufacturer: Yageo; Power (Watts): 0.125W, 1/8W; Temperature Coefficient: ±100ppm/°C; Part Number: AC0805FR-074K7L; Value: 4.7 kOhms; ComponentLink1Description: Datasheet; ComponentLink1URL: https://www.yageo.com/upload/media/product/productsearch/datasheet/rchip/PYu-AC_51_RoHS_L_7.pdf; ComponentLink2Description: DigiKey Link; ComponentLink2URL: https://www.digikey.com/en/products/detail/yageo/AC0805FR-074K7L/5896876; Composition: Thick Film; Device Package: 0805 (2012 Metric); Features: Automotive AEC-Q200, Moisture Resistant; Height - Seated (Max): 0.024" (0.60mm); LastUpdated: 14-11-2023 20:58:50; Lifecycle Status: Active; Minimum Order: 1; Number of Terminations: 2; Operating Temperature: -55°C ~ 155°C; Package / Case: 0805 (2012 Metric); Packaging: TapeAndReel; PartId: 34661; Part Status: Active; Price: 0.01; Ratings: AEC-Q200; Resistance: 4.7 kOhms; Series: AC; Size / Dimension: 0.079" L x 0.049" W (2.00mm x 1.25mm); Supplier 1: DigiKey; Supplier Part Number 1: YAG3738CT-ND; Supplier Device Package: 0805; Tolerance: ±1%
R10 R17 R18 R21 R22 R27 R28 R38-R51 Rfbt1 Rfreq1 Rfreq2 RPGOOD1 RPGOOD2 = 1-2176092-8: RES SMD 1K OHM 0.1% 1/4W 0805; Manufacturer: TE Connectivity Passive Product; Power (Watts): 0.25W, 1/4W; Resistance: 1 kOhms; Temperature Coefficient: ±25ppm/°C; Part Number: 1-2176092-8; ComponentLink1Description: Datasheet; ComponentLink1URL: https://www.te.com/commerce/DocumentDelivery/DDEController?Action=srchrtrv&DocNm=1773272&DocType=DS&DocLang=English; ComponentLink2Description: DigiKey Link; ComponentLink2URL: https://www.digikey.com/en/products/detail/te-connectivity-passive-product/1-2176092-8/4034011; Composition: Thin Film; Device Package: 0805 (2012 Metric); Height - Seated (Max): 0.026" (0.65mm); LastUpdated: 16-11-2023 20:53:44; Lifecycle Status: Active; Minimum Order: 1; Number of Terminations: 2; Operating Temperature: -55°C ~ 155°C; Package / Case: 0805 (2012 Metric); Packaging: TapeAndReel; PartId: 28484; Part Status: Active; Price: 0.14; Series: RP73P, Holsworthy; Size / Dimension: 0.079" L x 0.049" W (2.00mm x 1.25mm); Supplier 1: DigiKey; Supplier Part Number 1: A110543CT-ND; Supplier Device Package: 0805; Tolerance: ±0.1%
  R10: Value: 24.9KOhms
  R17: Value: 261ohms
  R18: Value: 8060 Ohms
  R21: Value: 500 Ohms
  R22: Value: 667 Ohms
  R27: Value: 30900 Ohms
  R28: Value: 2 kOhms
  R38 R39 R49 R51: Value: 18 kOhms
  R40 R42 R48 R50: Value: 10 kOhms
  R41 R47: Value: 1.13 MOhms
  R43 Rfbt1 RPGOOD1 RPGOOD2: Value: 100 kOhms
  R44: Value: 400 kOhms
  R45: Value: 250 kOhms
  R46: Value: 5 kOhms
  Rfreq1 Rfreq2: Value: 78.7kOhms
R16 = CFN0805-FX-R020ELF: RES 0.02 OHM 1% 3/4W 0805; Manufacturer: Bourns Inc.; Power (Watts): 0.75W, 3/4W; Temperature Coefficient: ±100ppm/°C; Part Number: CFN0805-FX-R020ELF; Value: 20 mOhms; ComponentLink1Description: Datasheet; ComponentLink1URL: //media.digikey.com/pdf/Data%20Sheets/Bourns%20PDFs/CFN_Series_Metal_Foil_DS.pdf; ComponentLink2Description: DigiKey Link; ComponentLink2URL: https://www.digikey.com/en/products/detail/bourns-inc/CFN0805-FX-R020ELF/9924212; Composition: Metal Foil; Device Package: 0805 (2012 Metric); Features: Current Sense, Moisture Resistant; Height - Seated (Max): 0.035" (0.90mm); LastUpdated: 16-11-2023 20:52:47; Lifecycle Status: Active; Minimum Order: 1; Number of Terminations: 2; Operating Temperature: -55°C ~ 155°C; Package / Case: 0805 (2012 Metric); Packaging: TapeAndReel; PartId: 45424; Part Status: Active; Price: 0.08; Resistance: 20 mOhms; Series: CFN; Size / Dimension: 0.079" L x 0.049" W (2.00mm x 1.25mm); Supplier 1: DigiKey; Supplier Part Number 1: CFN0805-FX-R020ELFCT-ND; Supplier Device Package: 0805; Tolerance: ±1%
R19 R20 R24-R26 R29-R33 R35-R37 = 1-2176092-8: RES SMD 1K OHM 0.1% 1/4W 0805; Manufacturer: TE Connectivity Passive Product; Power (Watts): 0.25W, 1/4W; Temperature Coefficient: ±25ppm/°C; Part Number: 1-2176092-8; Value: 1 kOhms; ComponentLink1Description: Datasheet; ComponentLink1URL: https://www.te.com/commerce/DocumentDelivery/DDEController?Action=srchrtrv&DocNm=1773272&DocType=DS&DocLang=English; ComponentLink2Description: DigiKey Link; ComponentLink2URL: https://www.digikey.com/en/products/detail/te-connectivity-passive-product/1-2176092-8/4034011; Composition: Thin Film; Device Package: 0805 (2012 Metric); Height - Seated (Max): 0.026" (0.65mm); LastUpdated: 16-11-2023 20:53:44; Lifecycle Status: Active; Minimum Order: 1; Number of Terminations: 2; Operating Temperature: -55°C ~ 155°C; Package / Case: 0805 (2012 Metric); Packaging: TapeAndReel; PartId: 28484; Part Status: Active; Price: 0.14; Resistance: 1 kOhms; Series: RP73P, Holsworthy; Size / Dimension: 0.079" L x 0.049" W (2.00mm x 1.25mm); Supplier 1: DigiKey; Supplier Part Number 1: A110543CT-ND; Supplier Device Package: 0805; Tolerance: ±0.1%
R23 R34 = 1-2176091-0: RES SMD 71.5 OHM 0.1% 1/4W 0805; Manufacturer: TE Connectivity Passive Product; Power (Watts): 0.25W, 1/4W; Resistance: 71.5 Ohms; Temperature Coefficient: ±25ppm/°C; Part Number: 1-2176091-0; Value: 24.9 kOhms; ComponentLink1Description: Datasheet; ComponentLink1URL: https://www.te.com/commerce/DocumentDelivery/DDEController?Action=srchrtrv&DocNm=1773272&DocType=DS&DocLang=English; ComponentLink2Description: DigiKey Link; ComponentLink2URL: https://www.digikey.com/en/products/detail/te-connectivity-passive-product/1-2176091-0/4033901; Composition: Thin Film; Device Package: 0805 (2012 Metric); Height - Seated (Max): 0.026" (0.65mm); LastUpdated: 09-08-2023 20:16:52; Lifecycle Status: Active; Minimum Order: 1; Number of Terminations: 2; Operating Temperature: -55°C ~ 155°C; Package / Case: 0805 (2012 Metric); Packaging: TapeAndReel; PartId: 47593; Part Status: Active; Price: 0.14; Series: RP73P, Holsworthy; Size / Dimension: 0.079" L x 0.049" W (2.00mm x 1.25mm); Supplier 1: DigiKey; Supplier Part Number 1: A110433CT-ND; Supplier Device Package: 0805; Tolerance: ±0.1%
U1 U4 = CMP-0272-01669-3: 11 MHz, Single Supply, Low Noise, Precision, Rail-to-Rail Output, JFET Amplifier, 4.5 to 36 V, -40 to 125 degC, 14-pin SOP (PW14), Green (RoHS & no Sb/Br); Manufacturer: Texas Instruments; IIB(Max)(pA): 10; Offset Drift(Typ)(uV/C): 0.35; GBW(Typ)(MHz): 11; Iq per channel(Max)(mA): 2; Sub Family: High Supply Voltage Amplifier (>=30V), Low Input Bias Current Amp (<=10pA), Low Noise Amp (<=10nV/rtHz), Low Offset Voltage Amplifier (<=500uV), Precision Amplifier; Slew Rate(Typ)(V/us): 20; CMRR(Min)(dB): 126; Rating: Catalog; Total Supply Voltage(Max)(+5V is 5, +/-5V is 10): 36; Packing: LARGE T&R; Total Supply Voltage(Min)(+5V is 5, +/-5V is 10): 4.5; Number of Channels: 4; Vio (25C)(Max)(mV): 0.12; ComponentLink1URL: http://www.ti.com/; DatasheetVersion: SBOS498A; ComponentLink2Description: Datasheet; Mounting Technology: Surface Mount; PackageDescription: 14-Pin Plastic Small Outline, Body 5 x 4.4 mm, Pitch 0.65 mm; Eco-Plan: Green (RoHS & no Sb/Br); PackageVersion: 4040064-3/G, 02/2011; PartNumber: OPA4140AIPWR; ComponentLink2URL: http://www.ti.com/lit/ds/symlink/opa4140.pdf; Code_JEDEC: MO-153; ComponentLink3Description: Package Specification; PackageReference: PW0014A; ComponentLink1Description: Manufacturer URL; ComponentLink3URL: http://www.ti.com/litv/pdf/mpds360
U2 U3 = CMP-04918-000121-1: IC REG BUCK ADJUSTABLE 6A 30WQFN; Manufacturer: Texas Instruments; Standoff Height: 0mm; Automotive Grade: Grade 1; Max Duty Cycle: 97.5%; Switching Frequency: 350-2200kHz; Max Supply Voltage: 36V; Min Supply Voltage: 3.5V; Output Voltage: 1-34V; Max Junction Temp: +150°C; Output Type: AdjustableProgrammable; Number Of Outputs: 1; Nominal Supply Current: 15uA; Automotive: Yes; Manufacturer Part Number: LM73606QRNPTQ1; Ambient Temperature Range High: +125°C; Temperature Range Low: -40°C; Device Class L1: Integrated Circuits (ICs); Output Current: 6A; Device Class L3: Voltage Regulators - Switching; Temperature Range High: +125°C; Lead Free: Yes; Mouser Description: 3.5V to 36V, 6A Synchronous Step-Down Voltage Converter 30-WQFN -40 to 125; RoHS: TRUE; Device Class L2: Power Management ICs; Package: RNP0030A; Height: 0.8mm; Category: IC; Octopart: https://octopart.com/lm73606qrnptq1-texas+instruments-87960447; ComponentLink2URL: http://www.ti.com/lit/ds/symlink/lm73605-q1.pdf; ComponentLink2Description: Datasheet; Switching Topology: Buck; Ambient Temperature Range Low: -40°C; Digikey Description: IC REG BUCK ADJUSTABLE 6A 30WQFN; Temperature: -40°C to +125°C
U5 = CMP-00004-1: Comparator Push pull output
U6 = CMP-00001-1: Comparator quad; PartId: 1
U7 = CMP-1627-00175-2: Automotive Catalog Quad 2-Input Positive-NAND Gates, D0014A, LARGE T&R; Manufacturer: Texas Instruments; Generic Part Number: SN74HC00-Q1; Input Type: CMOS; Bits(#): 4; Output Drive (IOL/IOH)(Max)(mA): 5.2/-5.2; Technology Family: HC; Schmitt Trigger: No; ICC @ Nom Voltage(Max)(mA): 0.02; F @ Nom Voltage(Max)(Mhz): 70; VCC(Min)(V): 2; Voltage(Nom)(V): 5; tpd @ Nom Voltage(Max)(ns): 23; VCC(Max)(V): 6; Rating: Automotive; PackageReference: D0014A; Operating Temperature Range(C): -40 to 125; Code_JEDEC: MS-012; Output Type: CMOS; DatasheetVersion: SCLS575